# EAGLE design AND Gate (EAGLE 6.5.0)
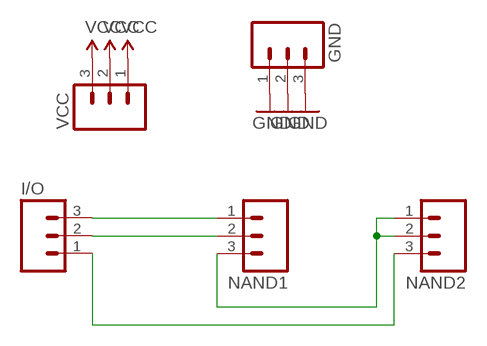
[diagram p0: schematic, sheet 1]

## Parts
GND  M03LOCK  [1X03_LOCK]
I/O  M03LOCK  [1X03_LOCK]
NAND1  M03LOCK  [1X03_LOCK]
NAND2  M03LOCK  [1X03_LOCK]
VCC  M03LOCK  [1X03_LOCK]

## Nets
GND: GND.1 GND.2 GND.3
N$1: I/O.1 NAND2.3
N$2: NAND1.3 NAND2.1 NAND2.2
N$3: I/O.3 NAND1.1
N$4: I/O.2 NAND1.2
VCC: VCC.1 VCC.2 VCC.3

## Library data of the parts
GND I/O NAND1 NAND2 VCC = SparkFun-Connectors:M03: Header 3 Standard 3-pin 0.1" header. Use with straight break away headers (SKU : PRT-00116), right angle break away headers (PRT-00553), swiss pins (PRT-00743), machine pins (PRT-00117), and female headers (PRT-00115). Molex polarized connector foot print use with SKU : PRT-08232 with associated crimp pins and housings.

## Board
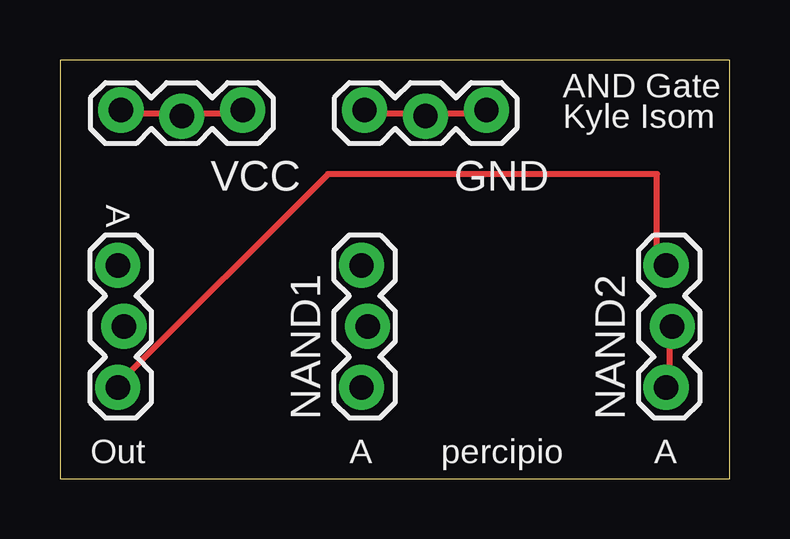
[diagram p1: board, top side]
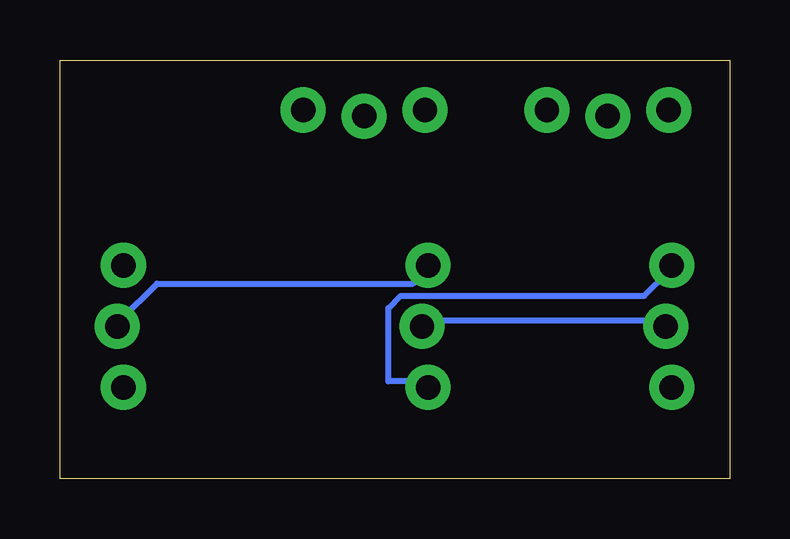
[diagram p2: board, bottom side, seen from below]

Size 27.92 x 17.45 mm. Coordinates in mm from the lower left corner, seen from the top.
Outline: 0,0 27.92,0 27.92,17.45 0,17.45 0,0
Copper layers (1*16): Top 0.035mm / dielectric 1.5mm / Bottom 0.035mm
Design rules "default": minimum track width 10mil, minimum drill 24mil, track to track 8mil, track to pad 8mil, pad to pad 8mil, via to via 8mil, smd to smd 8mil, copper to edge 40mil, drill to drill 8mil, minimum pad ring 10mil, minimum via ring 8mil, stop-mask expansion 4mil, vias tented up to drill 0mil, thermal gap 10mil

### Footprints (pad centres in the part's own frame; a part is rotated, then mirrored left to right if it is on the bottom)
1X03_LOCK = drill 1.016 pad 1.88: 1 0,0.127; 2 2.54,-0.127; 3 5.08,0.127

### Placement (x,y rotation side)
GND  12.7,15.24 0 top
I/O  2.54,3.81 90 top
NAND1  12.7,3.81 90 top
NAND2  25.4,3.81 90 top
VCC  2.54,15.24 0 top

### Tracks (layer width: path | path; a pad name or v marks a point on that pad's centre or on a via)
GND
  Top 0.254: 15.24,15.24 12.7,15.24 GND.1 | 15.24,15.24 17.78,15.24 GND.3 | 15.24,15.24 GND.2
N$1
  Top 0.254: I/O.1 2.54,4.06 11.18,12.7 24.89,12.7 24.89,9.14 NAND2.3
N$2
  Top 0.254: NAND2.1 25.4,4.06 25.4,6.1 NAND2.2
  Bottom 0.254: NAND1.3 12.7,8.64 13.21,8.13 23.88,8.13 25.4,6.6 NAND2.2
N$3
  Bottom 0.254: I/O.3 2.54,8.64 3.56,7.62 13.72,7.62 14.22,7.11 14.22,4.06 12.7,4.06 NAND1.1
N$4
  Bottom 0.254: I/O.2 3.05,6.6 12.7,6.6 NAND1.2
VCC
  Top 0.254: 5.08,15.24 2.54,15.24 VCC.1 | 5.08,15.24 7.62,15.24 VCC.3 | 5.08,15.24 VCC.2

### Text on the board
tPlace: AND Gate | Kyle Isom | A | Out | A | percipio | A